# EAGLE design TPS26630 test (EAGLE 9.6.2)
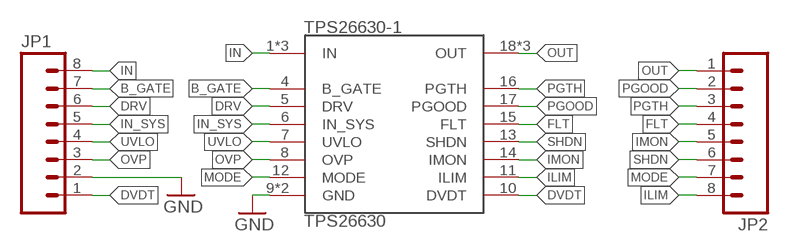
[diagram p0: schematic, sheet 1]

## Parts
JP1  M08  [1X08]
JP2  M08  [1X08]
TPS26630-1  TPS26630  [HTSSOP-20]

## Nets
B_GATE: JP1.7 TPS26630-1.4(B_GATE)
DRV: JP1.6 TPS26630-1.5(DRV)
DVDT: JP1.1 TPS26630-1.10(DVDT)
FLT: JP2.4 TPS26630-1.15(FLT)
GND: JP1.2 TPS26630-1.9(GND) TPS26630-1.PAD(GND)
ILIM: JP2.8 TPS26630-1.11(ILIM)
IMON: JP2.5 TPS26630-1.14(IMON)
IN: JP1.8 TPS26630-1.1(IN) TPS26630-1.2(IN) TPS26630-1.3(IN)
IN_SYS: JP1.5 TPS26630-1.6(IN_SYS)
MODE: JP2.7 TPS26630-1.12(MODE)
OUT: JP2.1 TPS26630-1.18(OUT) TPS26630-1.19(OUT) TPS26630-1.20(OUT)
OVP: JP1.3 TPS26630-1.8(OVP)
PGOOD: JP2.2 TPS26630-1.17(PGOOD)
PGTH: JP2.3 TPS26630-1.16(PGTH)
SHDN: JP2.6 TPS26630-1.13(SHDN)
UVLO: JP1.4 TPS26630-1.7(UVLO)

## Library data of the parts
JP1 JP2 = HyTechDevices:M08: Standard 8-pin 0.1" header. NOTES ON THE VARIANTS LOCK and LOCK_LONGPADS... This footprint was designed to help hold the alignment of a through-hole component (i.e. 6-pin header) while soldering it into place. You may notice that each hole has been shifted either up or down by 0.005 of an inch from it's more standard position (which is a perfectly straight line). This slight alteration caused the pins (the squares in the middle) to touch the edges of the holes. Because they are alternating, it causes a "brace" to hold the component in place. 0.005 has proven to be the perfect amount of "off-center" position when using our standard breakaway headers. Although looks a little odd when you look at the bare footprint, once you have a header in there, the alteration is very hard to notice. Also,if you push a header all the way into place, it is covered up entirely on the bottom side. This idea of altering the position of holes to aid alignment will be further integrated into the Sparkfun Library for other footprints. It can help hold any component with 3 or more connection pins. Note: The Sparkfun version includes many other packages including surface mount that may be of future interest. Source: Sparkfun <https://github.com/sparkfun/SparkFun-Eagle-Libraries>
TPS26630-1 = HyTechDevices:TPS26630

## Board
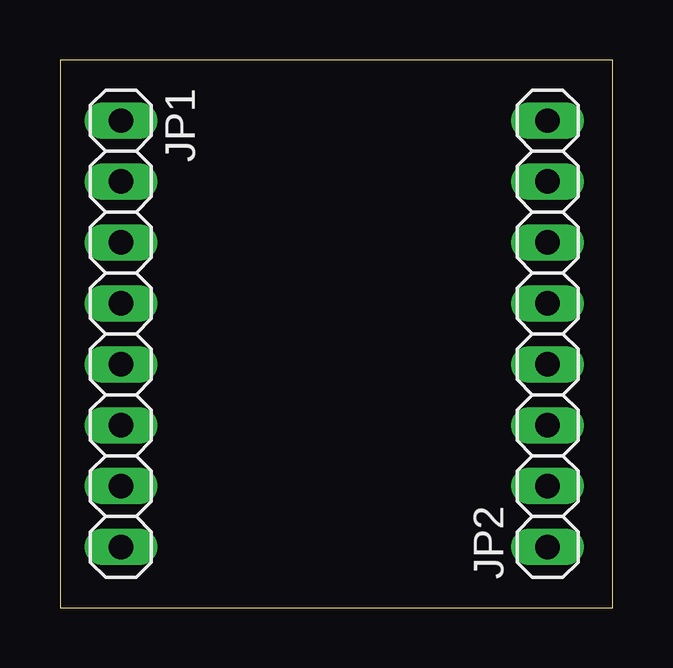
[diagram p1: board, top side]
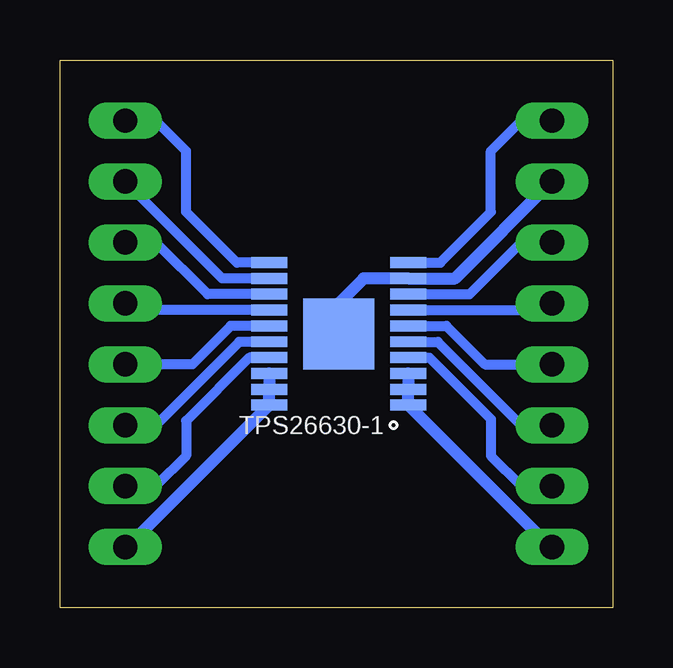
[diagram p2: board, bottom side, seen from below]

Size 23.04 x 22.85 mm. Coordinates in mm from the lower left corner, seen from the top.
Outline: 0,0 23.04,0 23.04,22.85 0,22.85 0,0
Copper layers 16: Bottom 0.035mm
Design rules "On Campus (1 Layer)": minimum track width 16mil, minimum drill 0.8mm, track to track 16mil, track to pad 12mil, pad to pad 16mil, via to via 16mil, smd to smd 10mil, copper to edge 40mil, drill to drill 10mil, minimum pad ring 10mil, minimum via ring 8mil, stop-mask expansion 4mil, vias tented up to drill 0mil, thermal gap 10mil

### Footprints (pad centres in the part's own frame; a part is rotated, then mirrored left to right if it is on the bottom)
1X08 = drill 1.016 long: 1 -8.89,0; 2 -6.35,0; 3 -3.81,0; 4 -1.27,0; 5 1.27,0; 6 3.81,0; 7 6.35,0; 8 8.89,0
HTSSOP-20 = smd 1.499 x 0.457: 1 -2.896,2.972; 2 -2.896,2.311; 3 -2.896,1.651; 4 -2.896,0.991; 5 -2.896,0.33; 6 -2.896,-0.33; 7 -2.896,-0.991; 8 -2.896,-1.651; 9 -2.896,-2.311; 10 -2.896,-2.972; 11 2.896,-2.972; 12 2.896,-2.311; 13 2.896,-1.651; 14 2.896,-0.991; 15 2.896,-0.33; 16 2.896,0.33; 17 2.896,0.991; 18 2.896,1.651; 19 2.896,2.311; 20 2.896,2.972 | smd 2.959 x 2.959: PAD 0,0

### Placement (x,y rotation side)
JP1  2.54,11.43 270 top
JP2  20.32,11.43 90 top
TPS26630-1  11.43,11.43 180 bottom

### Tracks (layer width: path | path; a pad name or v marks a point on that pad's centre or on a via)
B_GATE
  Bottom 0.406: TPS26630-1.4 7.64,10.44 5.08,7.87 5.08,6.35 3.81,5.08 JP1.7
DRV
  Bottom 0.406: TPS26630-1.5 7.29,11.1 3.81,7.62 JP1.6
DVDT
  Bottom 0.406: TPS26630-1.10 7.19,14.4 5.08,16.51 5.08,19.05 3.81,20.32 JP1.1
FLT
  Bottom 0.406: TPS26630-1.15 15.93,11.76 17.53,10.16 JP2.4
GND
  Bottom 0.508: TPS26630-1.PAD 11.43,12.7 10.39,13.74 TPS26630-1.9 6.58,13.74 JP1.2
ILIM
  Bottom 0.406: TPS26630-1.11 15.67,14.4 17.78,16.51 17.78,19.05 19.05,20.32 JP2.8
IMON
  Bottom 0.406: TPS26630-1.14 20.04,12.42 JP2.5
IN
  Bottom 0.508: JP1.8 2.62,2.54 TPS26630-1.1 TPS26630-1.2 TPS26630-1.3
IN_SYS
  Bottom 0.406: TPS26630-1.6 6.93,11.76 5.33,10.16 JP1.5
MODE
  Bottom 0.406: TPS26630-1.12 16.28,13.74 JP2.7
OUT
  Bottom 0.508: JP2.1 20.24,2.54 TPS26630-1.20 TPS26630-1.19 TPS26630-1.18
OVP
  Bottom 0.406: TPS26630-1.8 5.97,13.08 3.81,15.24 JP1.3
PGOOD
  Bottom 0.406: TPS26630-1.17 15.15,10.44 17.78,7.8 17.78,6.35 19.05,5.08 JP2.2
PGTH
  Bottom 0.406: TPS26630-1.16 15.57,11.1 19.05,7.62 JP2.3
SHDN
  Bottom 0.406: TPS26630-1.13 16.89,13.08 19.05,15.24 JP2.6
UVLO
  Bottom 0.406: TPS26630-1.7 2.82,12.42 JP1.4